# EasyEDA Pro project JP_Board.eprj, schematic Schematic1

## Sheets
1 MCU: Board Name: Board1; Create Date: 2025-09-01; Page Name: MCU; Project Name: JP_Board; Schematic Name: Schematic1; Update Date: 2025-11-07; Company: EasyEDA.com; Page Size: A4; Version: V1.0
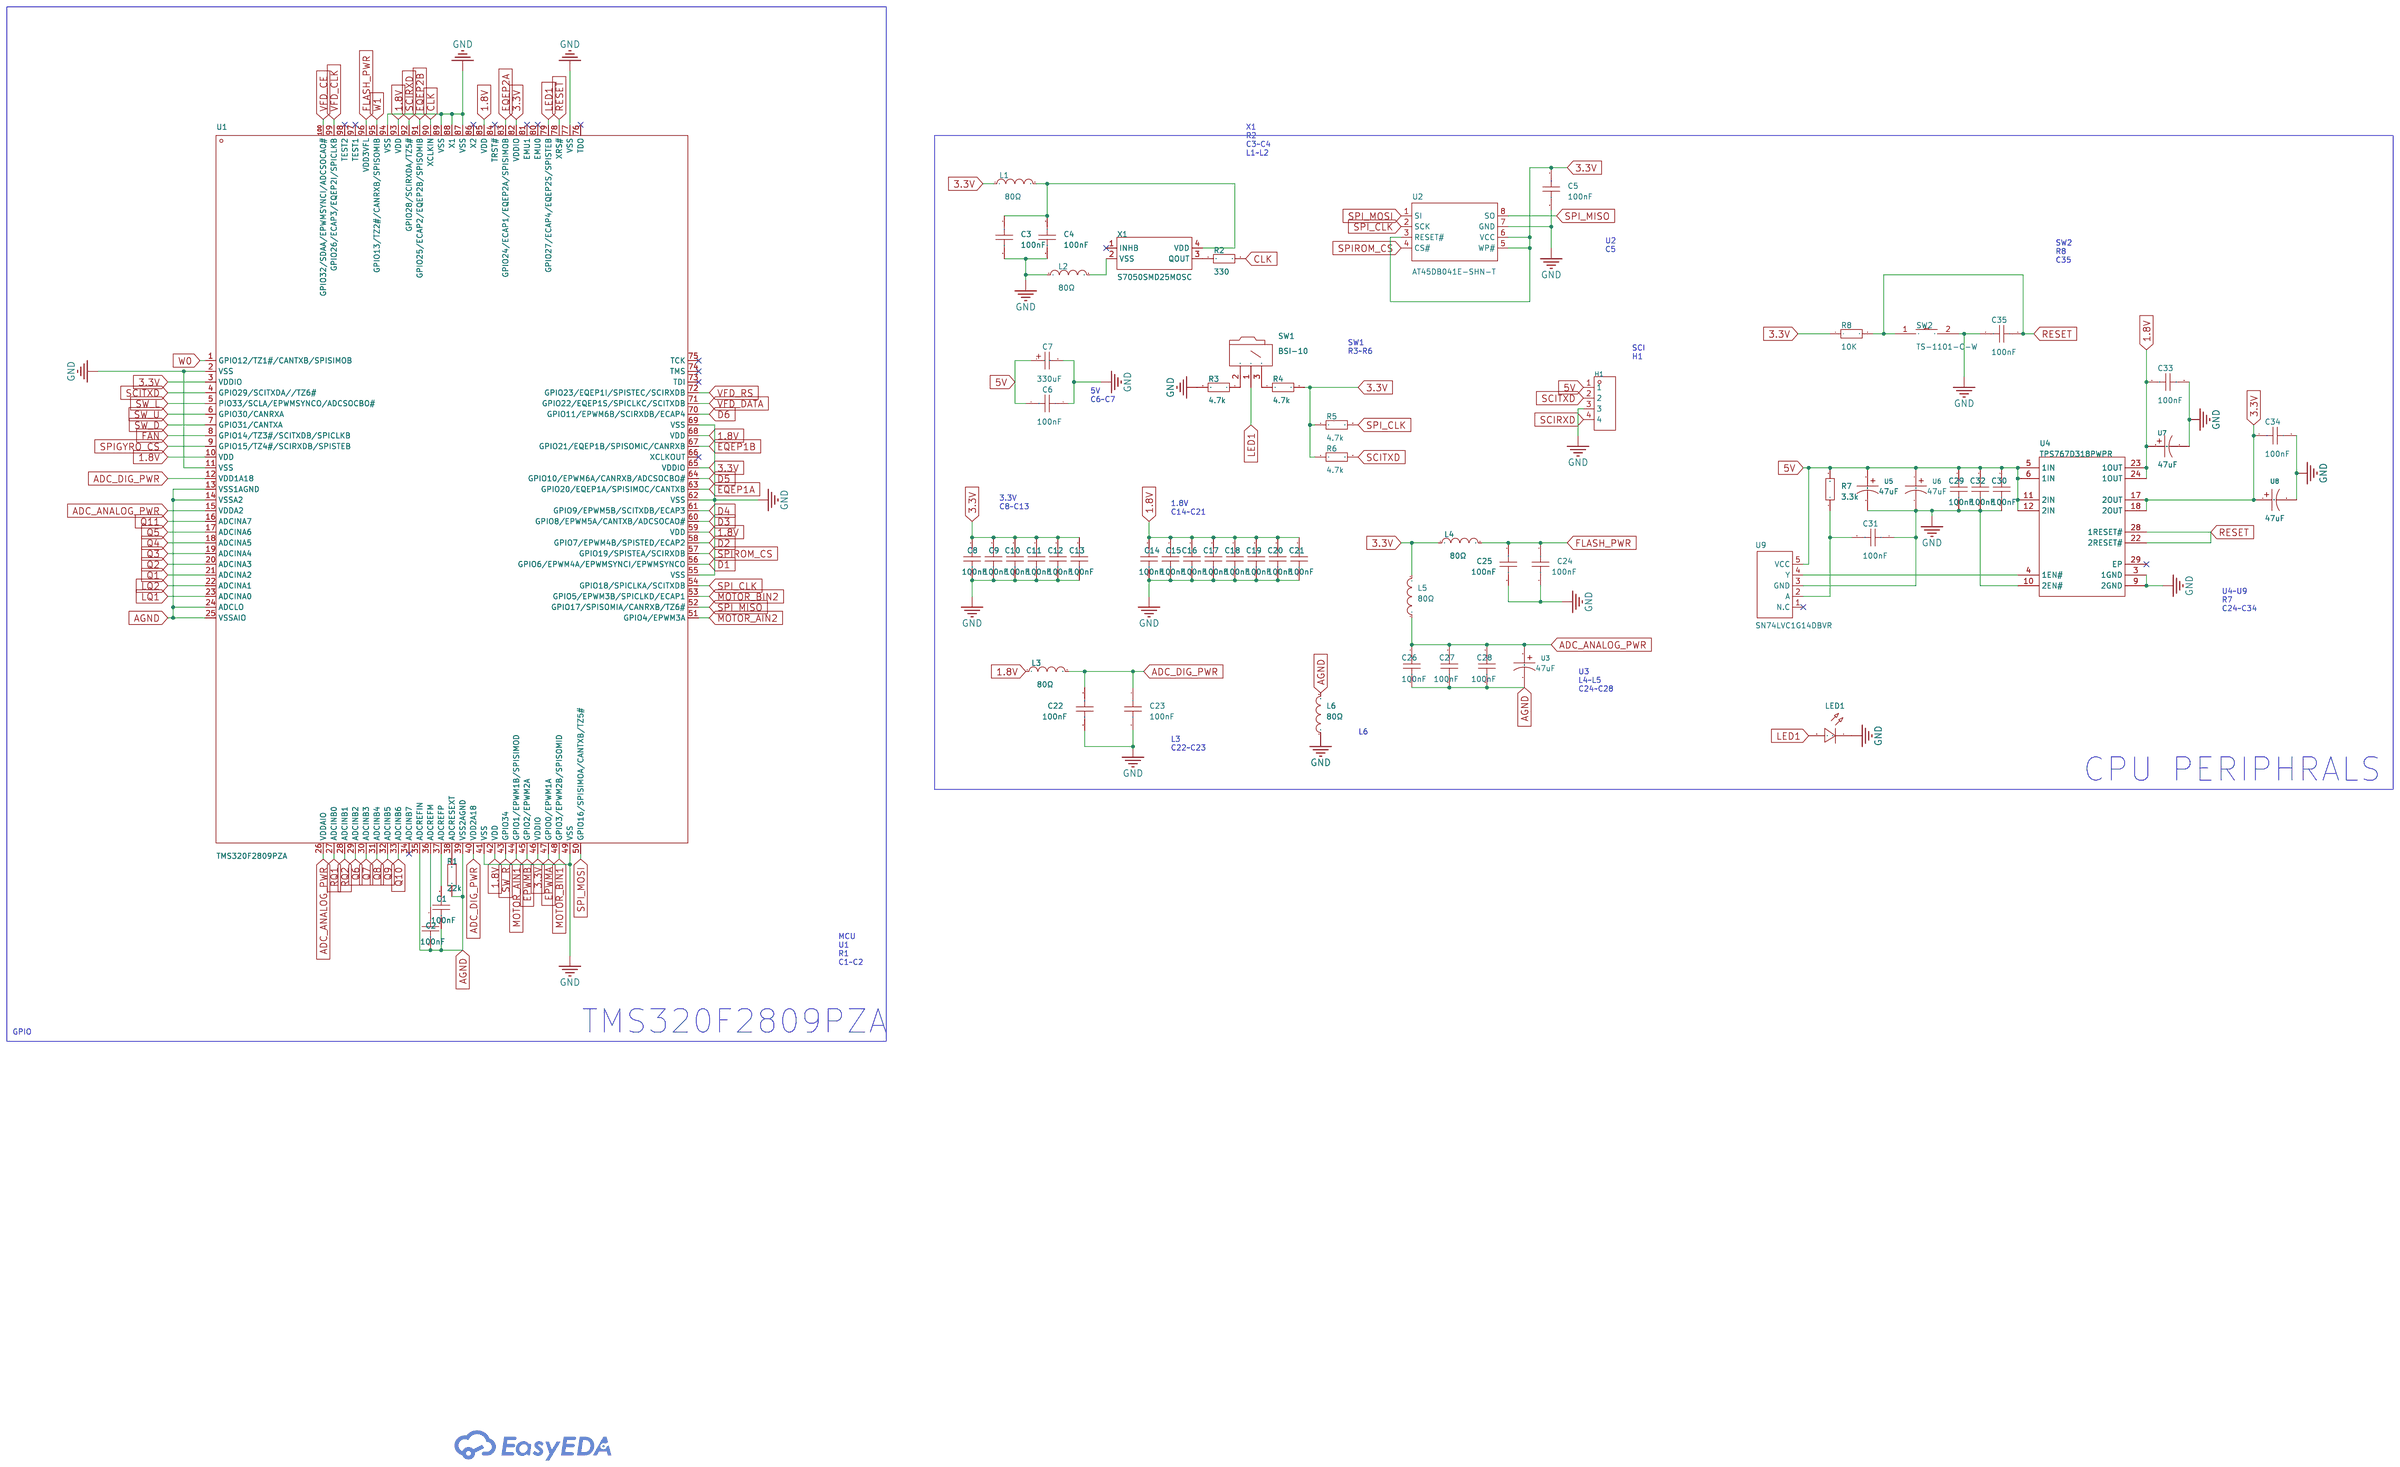
[diagram p0: MCU]
2 etc: Create Date: 2025-09-11; Page Name: etc; Update Date: 2025-11-08
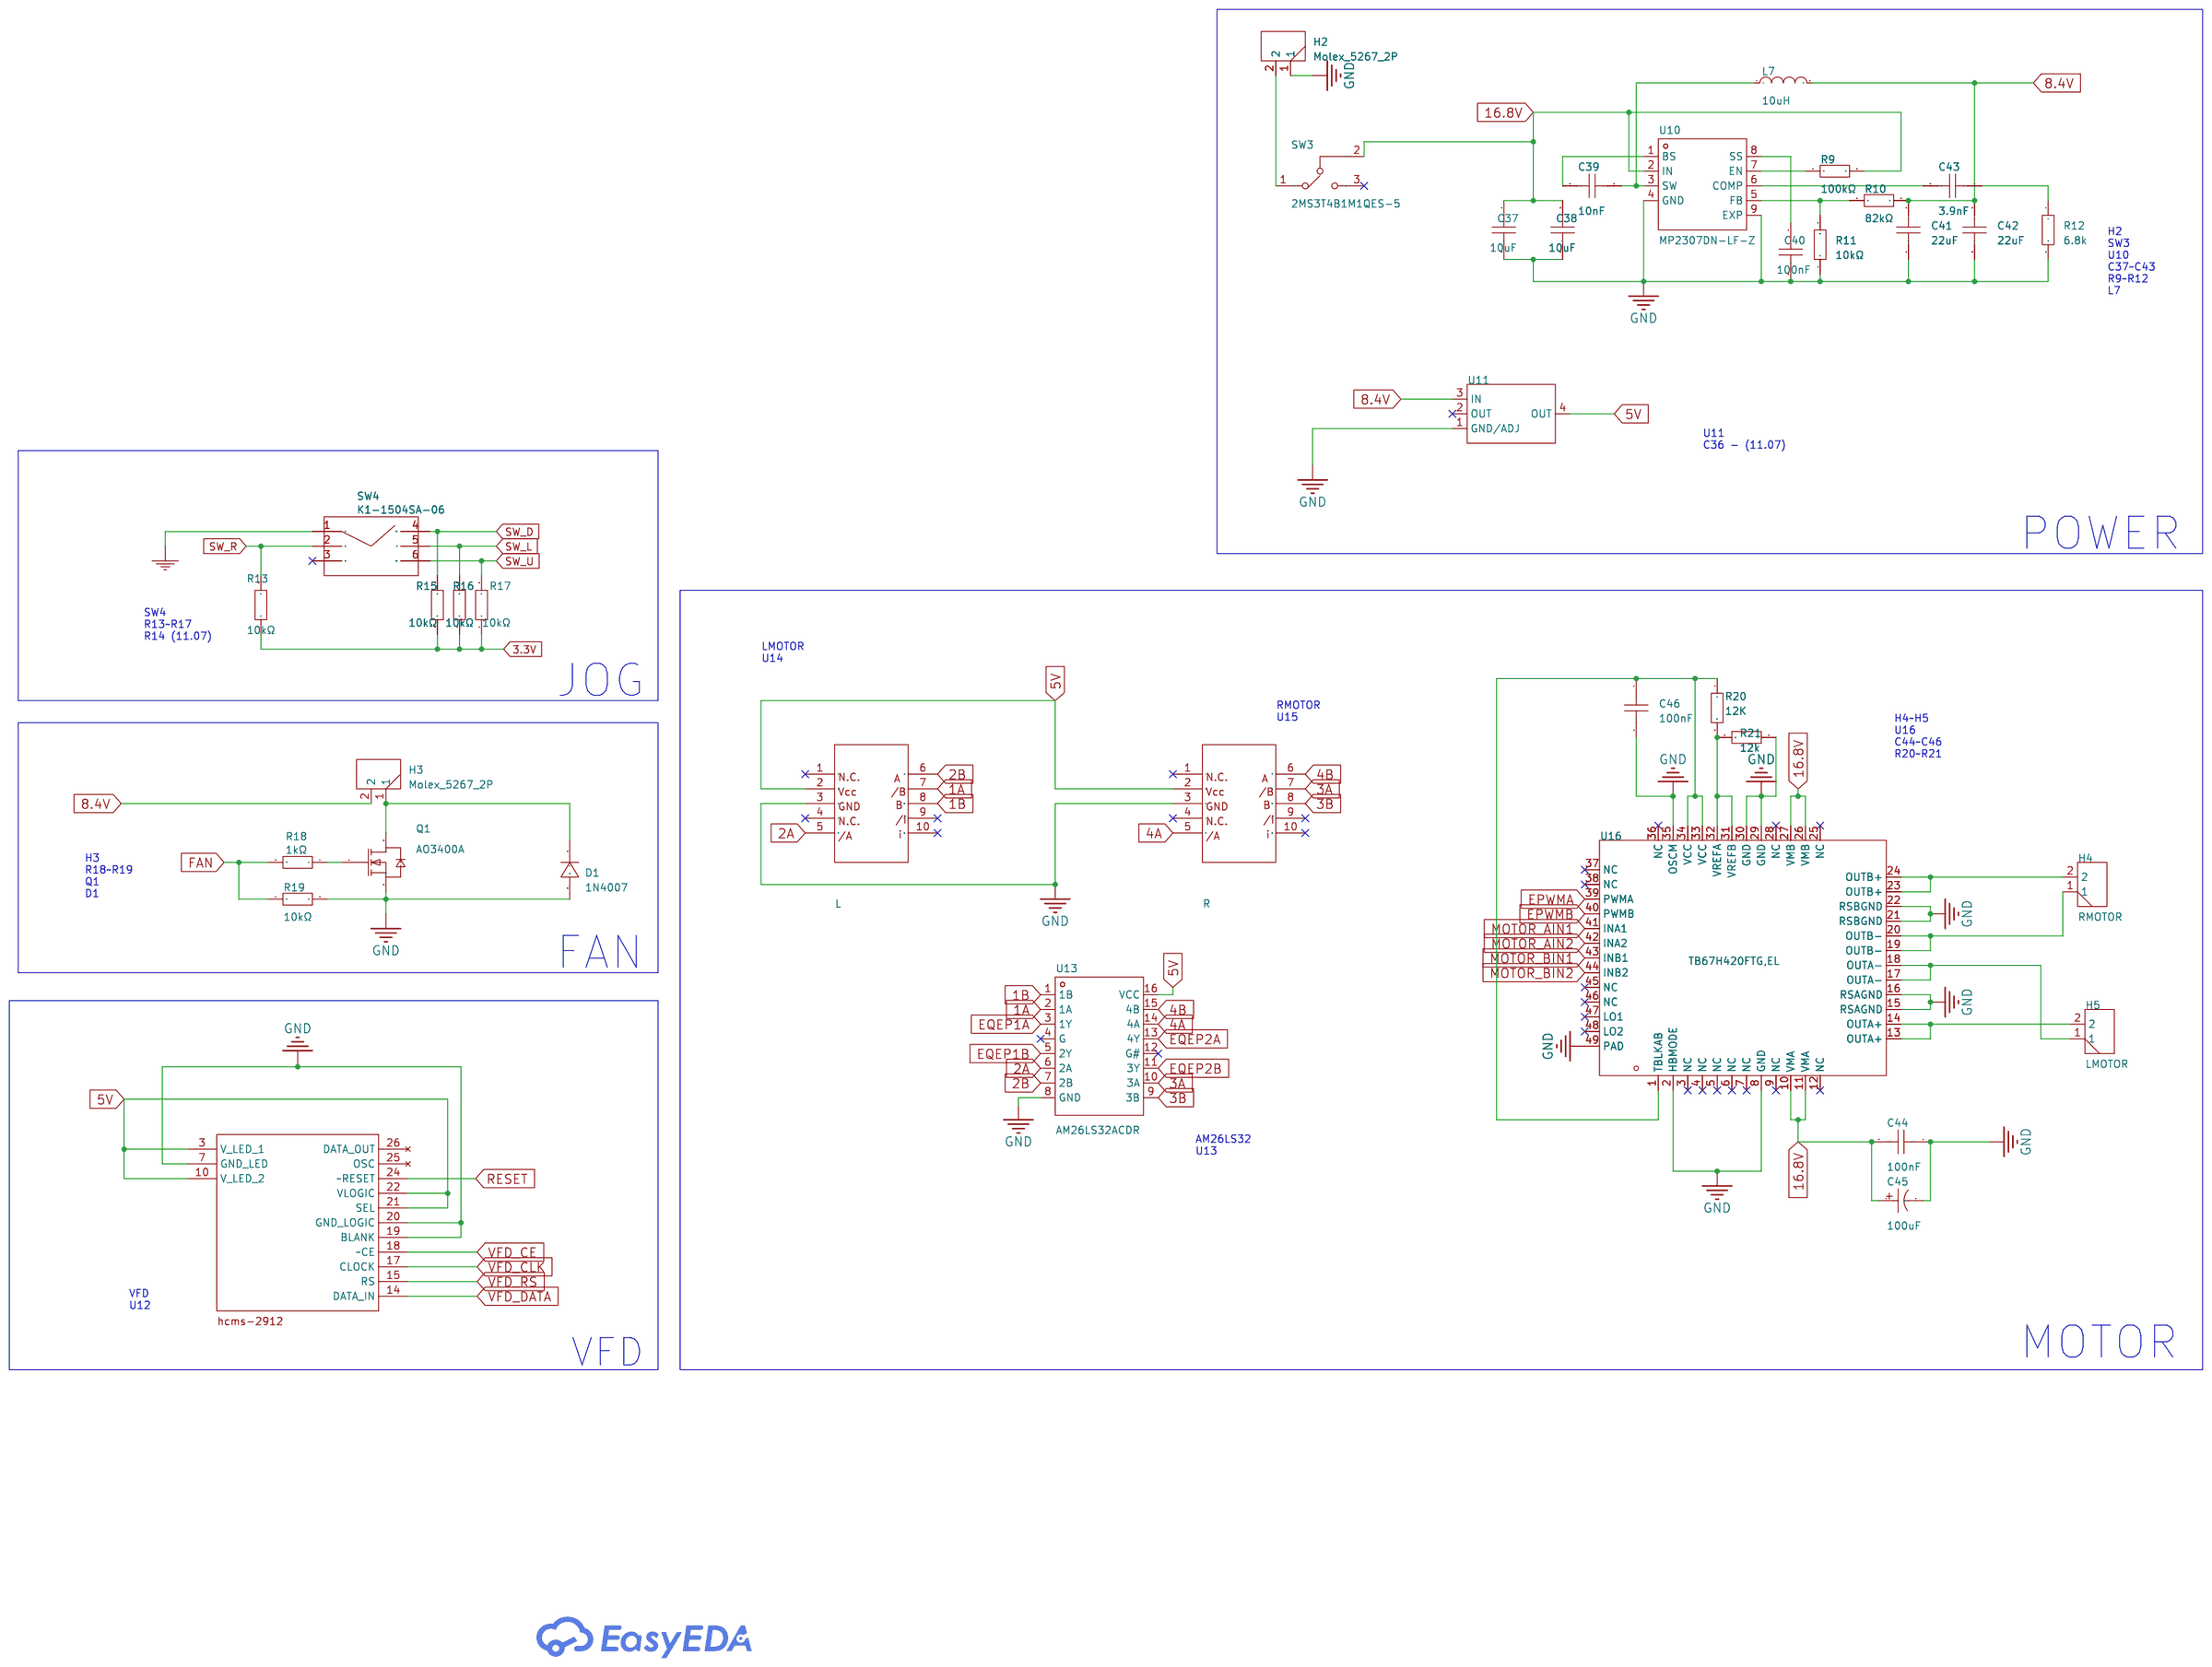
[diagram p1: etc]
3 SENSOR: Create Date: 2025-09-11; Page Name: SENSOR
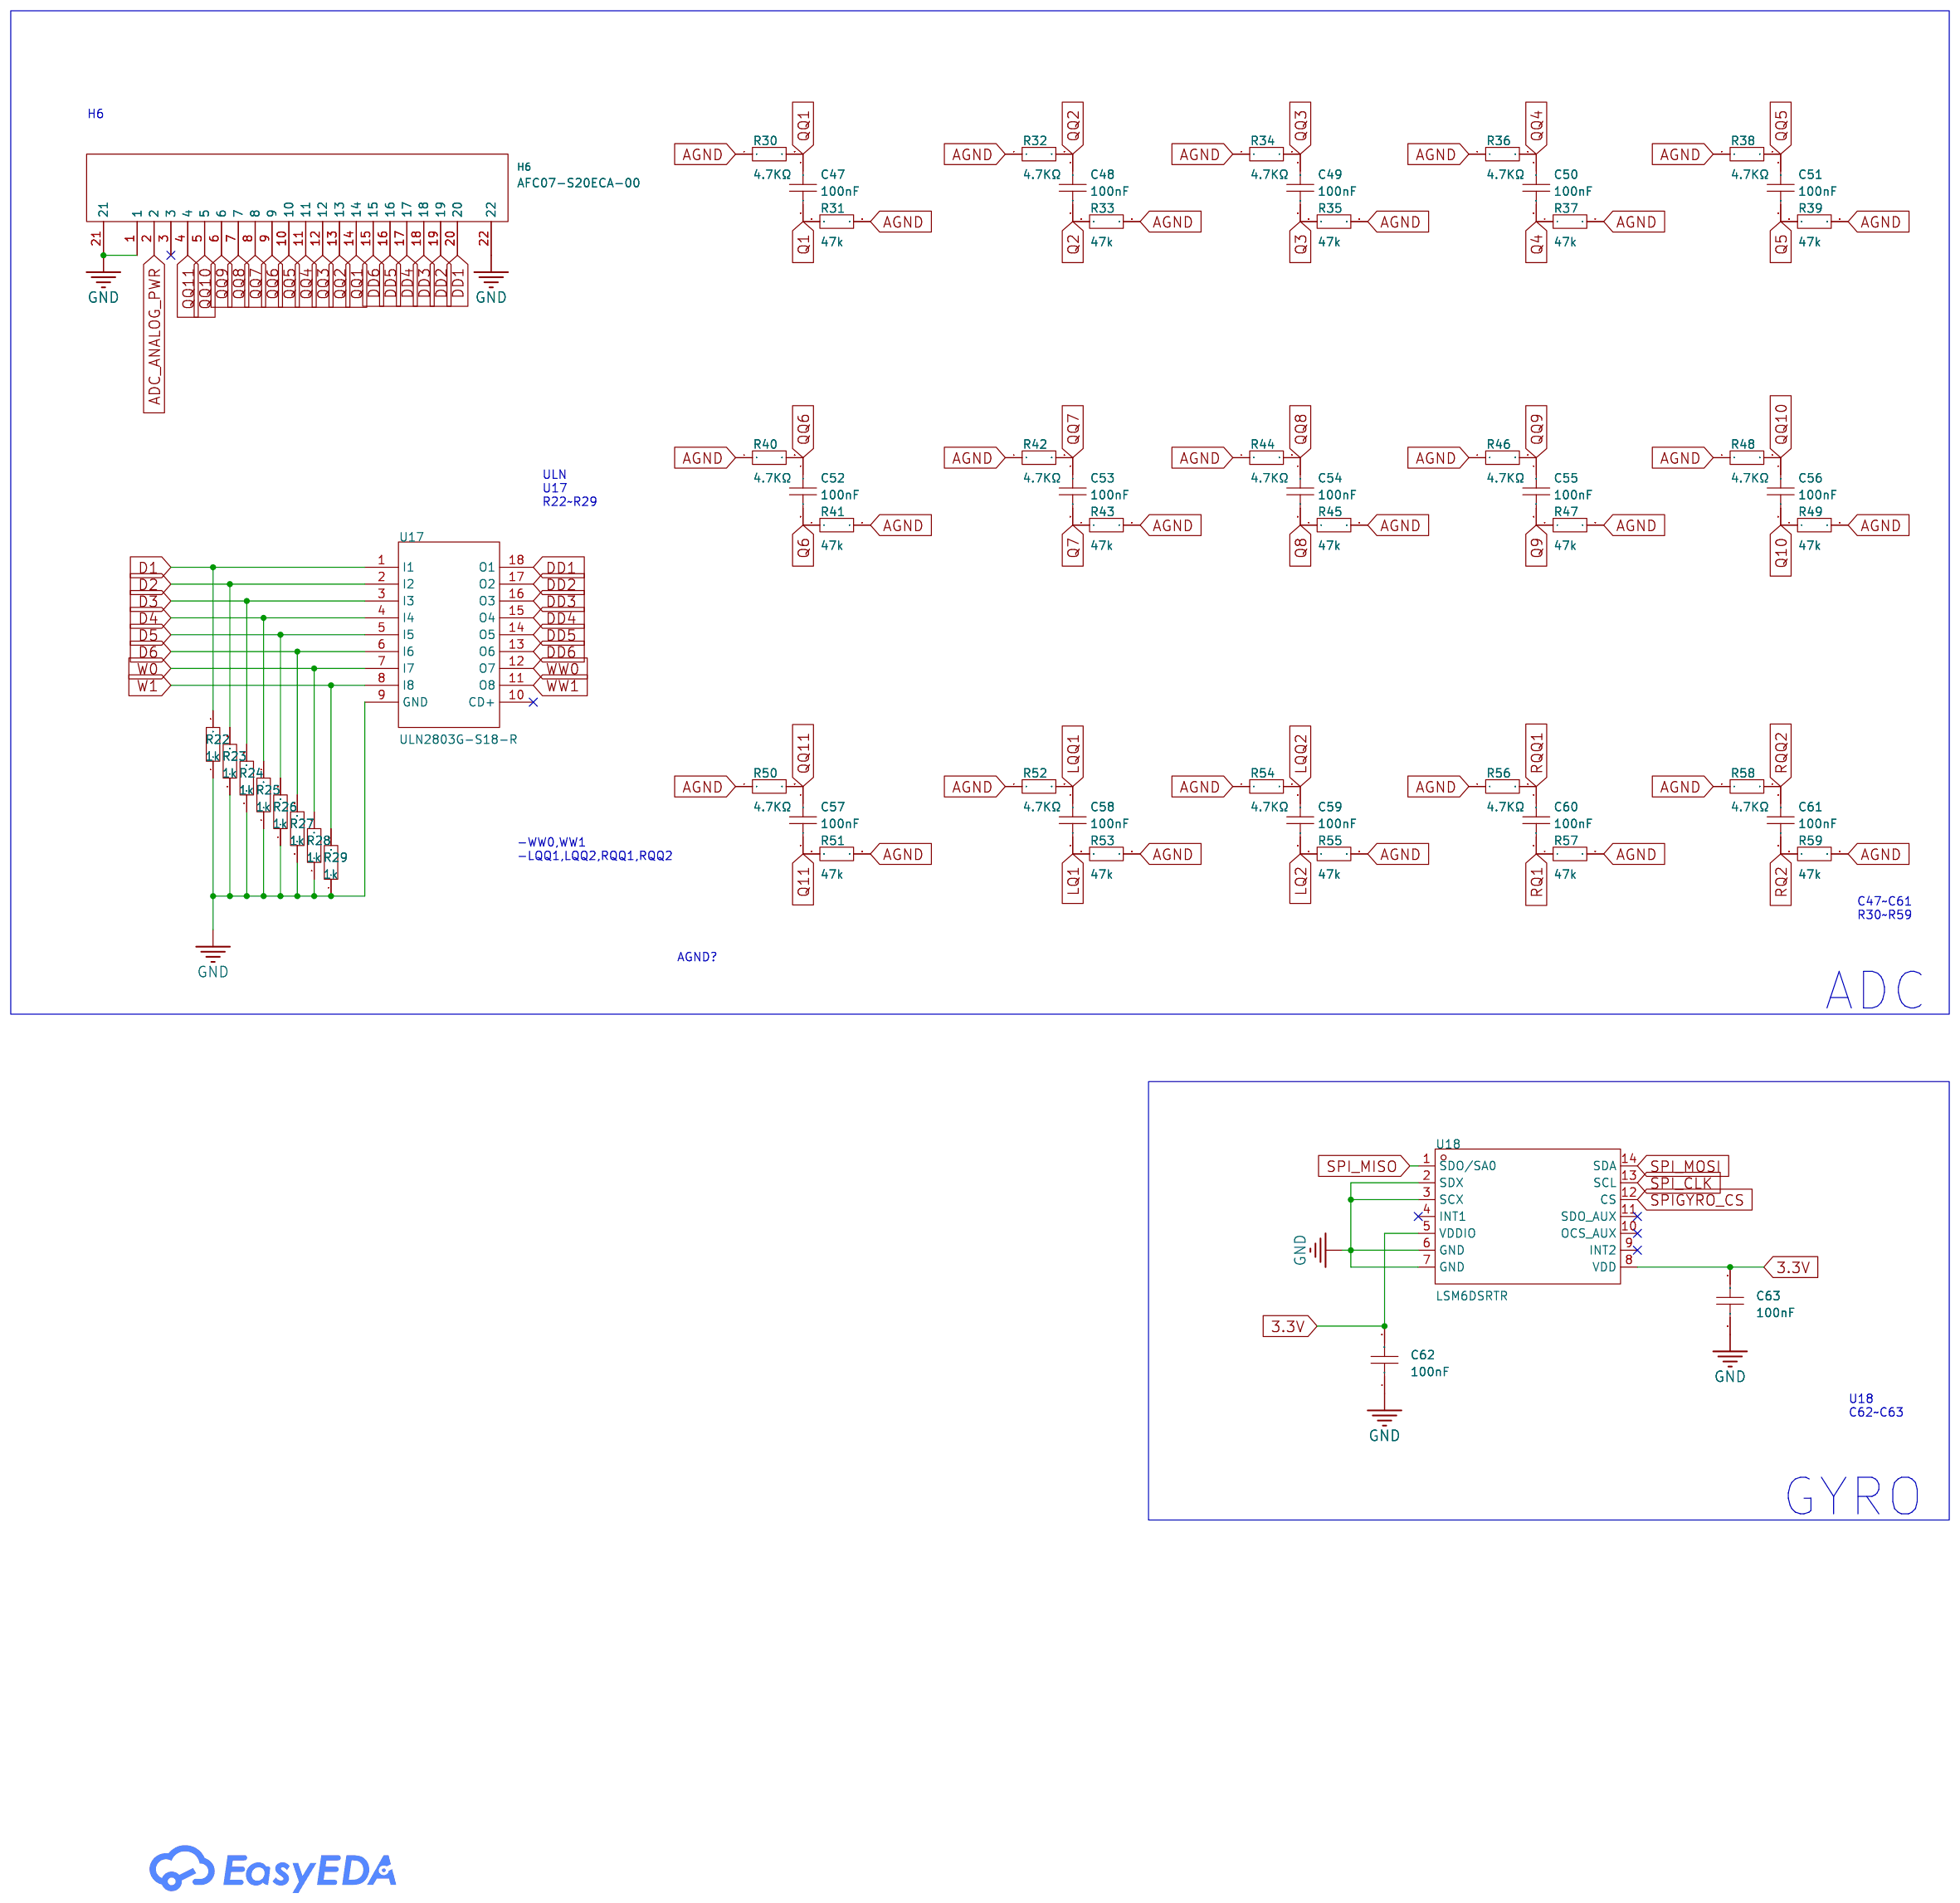
[diagram p2: SENSOR]

## Parts
sheet etc
C37  10uF  [C0603]
C38  10uF  [C0603]
C39  10nF  [C0603]
C40  100nF  [C0603]
C41  22uF  [C0603]
C42  22uF  [C0603]
C43  3.9nF  [C0603]
C44  100nF  [C0603]
C45  100uF  [CAP-SMD_BD6.3-L6.6-W6.6-FD]
C46  100nF  [C0603]
D1  1N4007  [SMA_L4.4-W2.8-LS5.4-RD]
H2  Molex_5267_2P  [5267_2P]
H3  Molex_5267_2P  [5267_2P]
H4  RMOTOR  [5267_2P]
H5  LMOTOR  [5267_2P]
L7  10uH  [IND-SMD_L7.3-W6.6]
Q1  AO3400A  [SOT-23-3_L3.0-W1.6-P1.90-LS2.8-BR]
R9  100kΩ  [R0603]
R10  82kΩ  [R0603]
R11  10kΩ  [R0603]
R12  6.8k  [R0603]
R13  10kΩ  [R0603]
R15  10kΩ  [R0603]
R16  10kΩ  [R0603]
R17  10kΩ  [R0603]
R18  1kΩ  [R0603]
R19  10kΩ  [R0603]
R20  12K  [R0603]
R21  12k  [R0603]
SW3  2MS3T4B1M1QES-5  [SW-TH_2MS3T4B1M1QES-5]
SW4  K1-1504SA-06  [SW-SMD_K1-1504SA-06]
U10  MP2307DN-LF-Z  [SOP-8_L4.9-W3.9-P1.27-LS6.0-BL-EP]
U11  AMS1117-5.0  [SOT-223-4_L6.5-W3.5-P2.30-LS7.0-BR]
U12  -  [HCMS-2912]
U13  AM26LS32ACDR  [SOIC-16_L9.9-W3.9-P1.27-LS6.0-BL]
U14  L  [Encoder]
U15  R  [Encoder]
U16  TB67H420FTG,EL  [QFN-48_L7.0-W7.0-P0.50-BL-EP5.4]
sheet MCU
C1  100nF  [C0603]
C2  100nF  [C0603]
C3  100nF  [C0603]
C4  100nF  [C0603]
C5  100nF  [C0603]
C6  100nF  [C0603]
C7  330uF  [CASE-D_7343]
C8  100nF  [C0603]
C9  100nF  [C0603]
C10  100nF  [C0603]
C11  100nF  [C0603]
C12  100nF  [C0603]
C13  100nF  [C0603]
C14  100nF  [C0603]
C15  100nF  [C0603]
C16  100nF  [C0603]
C17  100nF  [C0603]
C18  100nF  [C0603]
C19  100nF  [C0603]
C20  100nF  [C0603]
C21  100nF  [C0603]
C22  100nF  [C0603]
C23  100nF  [C0603]
C24  100nF  [C0603]
C25  100nF  [C0603]
C26  100nF  [C0603]
C27  100nF  [C0603]
C28  100nF  [C0603]
C29  100nF  [C0603]
C30  100nF  [C0603]
C31  100nF  [C0603]
C32  100nF  [C0603]
C33  100nF  [C0603]
C34  100nF  [C0603]
C35  100nF  [C0603]
H1  -  [HDR-TH_4P-P2.54-V-F]
L1  80Ω  [L0603]
L2  80Ω  [L0603]
L3  80Ω  [L0603]
L4  80Ω  [L0603]
L5  80Ω  [L0603]
L6  80Ω  [L0603]
LED1  -  [LED0603-R-RD]
R1  22k  [R0603]
R2  330  [R0603]
R3  4.7k  [R0603]
R4  4.7k  [R0603]
R5  4.7k  [R0603]
R6  4.7k  [R0603]
R7  3.3k  [R0603]
R8  10K  [R0603]
SW1  BSI-10  [SW-TH_BSI-10]
SW2  TS-1101-C-W  [SW-SMD_L6.0-W3.3-LS8.0]
U1  TMS320F2809PZA  [LQFP-100_L14.0-W14.0-P0.50-LS16.0-BL]
U2  AT45DB041E-SHN-T  [SOIC-8_L5.3-W5.3-P1.27-LS8.0-BL]
U3  47uF  [CAP-SMD_L1.6-W0.8]
U4  TPS767D318PWPR  [TSSOP-28_L9.7-W4.4-P0.65-LS6.4-BL-EP5.5]
U5  47uF  [CAP-SMD_L1.6-W0.8]
U6  47uF  [CAP-SMD_L1.6-W0.8]
U7  47uF  [CAP-SMD_L1.6-W0.8]
U8  47uF  [CAP-SMD_L1.6-W0.8]
U9  SN74LVC1G14DBVR  [SOT-23-5_L3.0-W1.7-P0.95-LS2.8-BR]
X1  S7050SMD25MOSC  [OSC-SMD_4P-L7.0-W5.0-BL-2]
sheet SENSOR
C47  100nF  [C0603]
C48  100nF  [C0603]
C49  100nF  [C0603]
C50  100nF  [C0603]
C51  100nF  [C0603]
C52  100nF  [C0603]
C53  100nF  [C0603]
C54  100nF  [C0603]
C55  100nF  [C0603]
C56  100nF  [C0603]
C57  100nF  [C0603]
C58  100nF  [C0603]
C59  100nF  [C0603]
C60  100nF  [C0603]
C61  100nF  [C0603]
C62  100nF  [C0603]
C63  100nF  [C0603]
H6  AFC07-S20ECA-00  [FPC-SMD_AFC07-S20ECA-00]
R22  1k  [R0603]
R23  1k  [R0603]
R24  1k  [R0603]
R25  1k  [R0603]
R26  1k  [R0603]
R27  1k  [R0603]
R28  1k  [R0603]
R29  1k  [R0603]
R30  4.7KΩ  [R0603]
R31  47k  [R0603]
R32  4.7KΩ  [R0603]
R33  47k  [R0603]
R34  4.7KΩ  [R0603]
R35  47k  [R0603]
R36  4.7KΩ  [R0603]
R37  47k  [R0603]
R38  4.7KΩ  [R0603]
R39  47k  [R0603]
R40  4.7KΩ  [R0603]
R41  47k  [R0603]
R42  4.7KΩ  [R0603]
R43  47k  [R0603]
R44  4.7KΩ  [R0603]
R45  47k  [R0603]
R46  4.7KΩ  [R0603]
R47  47k  [R0603]
R48  4.7KΩ  [R0603]
R49  47k  [R0603]
R50  4.7KΩ  [R0603]
R51  47k  [R0603]
R52  4.7KΩ  [R0603]
R53  47k  [R0603]
R54  4.7KΩ  [R0603]
R55  47k  [R0603]
R56  4.7KΩ  [R0603]
R57  47k  [R0603]
R58  4.7KΩ  [R0603]
R59  47k  [R0603]
U17  ULN2803G-S18-R  [SOIC-18_L11.6-W7.5-P1.27-LS10.3-BL]
U18  LSM6DSRTR  [LGA-14_L3.0-W2.5-P0.50-BR]

## Library data of the parts
C37-C44 C46-C63 = CC0603KRX7R9BB104: Capacitance:100nF Tolerance:±10% Tolerance:±10% Voltage Rating:50V Temperature Coefficient:X7R; LCSC Part Name: 100nF ±10% 50V; Supplier Part: C14663; Manufacturer: YAGEO(国巨); Supplier Footprint: 0603; JLCPCB Part Class: Basic Part; Datasheet: https://item.szlcsc.com/datasheet/CC0603KRX7R9BB104/15331.html; Supplier: LCSC; Tolerance: ±10%; Voltage Rating: 50V; Temperature Coefficient: X7R
C45 = RT1C101M0605: LCSC Part Name: 100uF ±20% 16V; Supplier Part: C267461; Manufacturer: ROQANG(容强); Supplier Footprint: SMD,D6.3xL5.4mm; JLCPCB Part Class: Extended Part; Datasheet: https://atta.szlcsc.com/upload/public/pdf/source/20180813/C267472_55C74989F74FEE2EA57202A0C1074BEF.pdf; Supplier: LCSC; Tolerance: ±20%; Voltage Rating: 16V; Ripple Current: 58mA@120Hz; Diameter: 6.3mm; Height - Seated (Max): 5.4mm; Lifetime: 2000hrs@125℃; Operating Temperature: -40℃~+105℃
D1 = 1N4007_C126233: Diode Configuration:Independent Type Forward Voltage (Vf@If):1.1V@1A Reverse Voltage (Vr): Rectified Current: Reverse Leakage Current (Ir):5uA@1kV; LCSC Part Name: 停产; Supplier Part: C126233; Manufacturer: SHIKUES(时科); Supplier Footprint: SMA(DO-214AC); JLCPCB Part Class: Extended Part; Datasheet: https://atta.szlcsc.com/upload/public/pdf/source/20170818/C126233_1503051236073895256.pdf; Supplier: LCSC; Diode Configuration: Independent Type; Forward Voltage (Vf@If): 1.1V@1A; Reverse Leakage Current (Ir): 5uA@1kV
H2-H5 = Molex_5267_2P
L7 = BMRB00060630100MA1: Inductance:10uH Tolerance:±20% Tolerance:±20% Current Rating:4A Current - Saturation(Isat):5.5A DC Resistance(DCR):68mΩ Type:Magnetic Shielded Inductor Ratings:-; LCSC Part Name: 10uH ±20% 5.5A; Supplier Part: C5201679; Manufacturer: Chilisin(奇力新); Supplier Footprint: SMD,6.6x7.3mm; JLCPCB Part Class: Extended Part; Datasheet: https://item.szlcsc.com/datasheet/BMRB00060630100MA1/5890754.html; Supplier: LCSC; Tolerance: ±20%; Current Rating: 4A; Current - Saturation(Isat): 5.5A; DC Resistance(DCR): 68mΩ; Type: Magnetic Shielded Inductor
Q1 = AO3400A_C5224194: LCSC Part Name: N沟道,电流:5.8A,耐压:30V; Supplier Part: C5224194; Manufacturer: ElecSuper(静芯); Supplier Footprint: SOT23-3L; JLCPCB Part Class: Extended Part; Datasheet: https://item.szlcsc.com/datasheet/AO3400A/5925703.html; Supplier: LCSC; Number: 1 N-Channel; Drain to Source Voltage: 30V; Current - Continuous Drain(Id): 5.8A; RDS(on): 21mΩ@10V; Pd - Power Dissipation: 1.4W; Gate Threshold Voltage (Vgs(th)): 1V@250uA; Gate Charge(Qg): 6.7nC@4.5V; Input Capacitance(Ciss): 550pF; Reverse Transfer Capacitance (Crss@Vds): 48pF; Operating Temperature: -55℃~+150℃; Type: N-Channel; Output Capacitance(Coss): 62pF
R9 R11 R19 = SCR0603J10K: Type:Thick Film Resistors Resistance: Tolerance:±5% Tolerance:±5% Power(Watts): Overload Voltage (Max): Operating Temperature Range:-55℃~+155℃ Operating Temperature Range:-55℃~+155℃; LCSC Part Name: 厚膜电阻 10kΩ ±5% 100mW; Supplier Part: C3017715; Manufacturer: VO(翔胜); Supplier Footprint: 0603; JLCPCB Part Class: Extended Part; Datasheet: https://atta.szlcsc.com/upload/public/pdf/source/20220513/247AF9639BA21CF93567DC289CCC6A22.pdf; Supplier: LCSC; Type: Thick Film Resistors; Tolerance: ±5%; Operating Temperature Range: -55℃~+155℃
R10 = FRR0603J103 TS: Type:Thick Film Resistor Resistance:10kΩ Tolerance:±5% Tolerance:±5% Power(Watts):100mW Voltage-Supply(Max):75V Temperature Coefficient:±100ppm/℃ Temperature Coefficient:±100ppm/℃ Operating Temperature:-55℃~+155℃ Operating Temperature:-55℃~+155℃; LCSC Part Name: 厚膜电阻 0603 10KΩ ±5% 100mW; Supplier Part: C49196789; Manufacturer: FOJAN(富捷); Supplier Footprint: 0603; JLCPCB Part Class: Extended Part; Datasheet: https://item.szlcsc.com/datasheet/FRR0603J103%2520TS/51599037.html; Supplier: LCSC; Type: Thick Film Resistor; Tolerance: ±5%; Power(Watts): 100mW; Voltage-Supply(Max): 75V; Temperature Coefficient: ±100ppm/℃; Operating Temperature: -55℃~+155℃
R12 = 0603WAF1003T5E: Type:Thick Film Resistor Resistance:100kΩ Tolerance:±1% Tolerance:±1% Power(Watts):100mW Voltage-Supply(Max):75V Temperature Coefficient:±100ppm/℃ Temperature Coefficient:±100ppm/℃ Operating Temperature:-55℃~+155℃ Operating Temperature:-55℃~+155℃; LCSC Part Name: 100kΩ ±1% 100mW 厚膜电阻; Supplier Part: C25803; Manufacturer: UNI-ROYAL(厚声); Supplier Footprint: 0603; JLCPCB Part Class: Basic Part; Datasheet: https://item.szlcsc.com/datasheet/0603WAF1003T5E/26546.html; Supplier: LCSC; Type: Thick Film Resistor; Tolerance: ±1%; Power(Watts): 100mW; Voltage-Supply(Max): 75V; Temperature Coefficient: ±100ppm/℃; Operating Temperature: -55℃~+155℃
R13 R15-R17 = 10kΩ: Supplier: LCSC; Manufacturer: UNI-ROYAL(厚声); Manufacturer Part: 0603WAF1002T5E; Supplier Part: C25804; JLCPCB Part Class: Basic Part
R18 = 1kΩ: Supplier: LCSC; Manufacturer: UNI-ROYAL(厚声); Manufacturer Part: 0603WAF1001T5E; Supplier Part: C21190; JLCPCB Part Class: Basic Part; link: https://lcsc.com/eda_search?q=C21190&%26type=1&ref=editor
R1-R8 R20-R29 R31 R33 R35 R37 R39 R41 R43 R45 R47 R49 R51 R53 R55 R57 R59 = Res_0603: Supplier Footprint: 0603
SW3 = 2MS3T4B1M1QES-5: LCSC Part Name: 三件套 开关 3件套; Supplier Part: C1122353; Manufacturer: Dailywell(德利威); Supplier Footprint: 插件,8.1x5.1mm; JLCPCB Part Class: Extended Part; Datasheet: https://item.szlcsc.com/datasheet/2MS3T4B1M1QES-5/1212718.html; Supplier: LCSC; Circuit: SPDT; Length: 8.13mm; Width: 5.08mm; Switch Height: 26.93mm; Life: 30,000 Cycles; Current Rating: 3A; Voltage Rating (AC): 120V; Voltage Rating (DC): 28V; Actuator Type: Cylinder Lever; Termination Style: PC Pin; Mounting Type: Through Hole; Operating Temperature: -30℃~+85℃
SW4 = K1-1504SA-06: Supplier: LCSC; Manufacturer: 韩国韩荣; Supplier Part: C136712; JLCPCB Part Class: Extended Part
U10 = MP2307DN-LF-Z: Function:Buck Output Type:Adjustable Voltage - Supply:4.75V~23V Voltage - Supply:4.75V~23V Output Voltage:925mV~20V Output Voltage:925mV~20V Output Current:3A Frequency - Switching:- Frequency - Switching:- Operating Temperature:-40℃~+85℃ Operating Temper; LCSC Part Name: 3A，23V，340KHz同步整流降压转换器; Supplier Part: C18921; Manufacturer: MPS(芯源); Supplier Footprint: SOIC-8N-EP-150mil; JLCPCB Part Class: Extended Part; Datasheet: https://item.szlcsc.com/datasheet/MP2307DN-LF-Z/19624.html; Supplier: LCSC; Function: Buck; Output Type: Adjustable; Voltage - Supply: 4.75V~23V; Output Voltage: 925mV~20V; Output Current: 3A; Operating Temperature: -40℃~+85℃; Synchronous Rectifier: Yes; Number of Outputs: 1; Topology: Buck; Switch tube (built-in/external): Built-in
U11 = AMS1117-5.0_C489390: Output Type:Fixed Voltage - Supply:18V Output Voltage:5V Output Voltage:5V Output Current:800mA Power Supply Rejection Ratio (PSRR):- Voltage Dropout:1.3V@(800mA) Features:热关断(TSD) Output Configuration:Positive electrode Number of Outputs:1; LCSC Part Name: 输入18V 输出5V 800mA; Supplier Part: C489390; Manufacturer: KEXIN(科信); Supplier Footprint: SOT-223-4; JLCPCB Part Class: Extended Part; Datasheet: https://atta.szlcsc.com/upload/public/pdf/source/20200225/C489390_741098F4D0B289080ED6EC6326BDA35D.pdf; Supplier: LCSC; Output Type: Fixed; Voltage - Supply: 18V; Output Voltage: 5V; Output Current: 800mA; Voltage Dropout: 1.3V@(800mA); Features: 热关断(TSD); Output Configuration: Positive electrode; Number of Outputs: 1
U12 = HCMS-2912
U13 = AM26LS32ACDR: LCSC Part Name: 四路差分线接收器; Supplier Part: C6180; Manufacturer: TI(德州仪器); Supplier Footprint: SOIC-16; JLCPCB Part Class: Extended Part; Datasheet: https://www.ti.com/cn/lit/gpn/am26ls32ac; Supplier: LCSC; Type: Receivers; Number of Drivers: 0; Number of Receivers: 4; Voltage - Supply: 4.75V~5.25V; Operating Temperature: 0℃~+70℃
U14 U15 = Encoder
U16 = TB67H420FTG,EL: LCSC Part Name: 9A 有刷直流电机驱动芯片 5.5V; Supplier Part: C2150535; Manufacturer: TOSHIBA(东芝); Supplier Footprint: QFN-48-EP(7x7); JLCPCB Part Class: Extended Part; Datasheet: https://atta.szlcsc.com/upload/public/pdf/source/20210718/C2150535_772875BEA68F83793892421782555318.pdf; Supplier: LCSC
C1-C6 C8-C35 = CAP_0603: Supplier Footprint: 0603
C7 = TAJD337K010RNJ: LCSC Part Name: 330uF ±10% 10V; Supplier Part: C7226; Manufacturer: Kyocera AVX; Supplier Footprint: CASE-D-7343; JLCPCB Part Class: Extended Part; Datasheet: https://atta.szlcsc.com/upload/public/pdf/source/20160107/1457707750344.pdf; Supplier: LCSC; Tolerance: ±10%; Equivalent Series Resistance(ESR): 900mΩ@100kHz; Operating Temperature: -55℃~+125℃
H1 = HDR-F_2.54_1x4P: Supplier Footprint: Through
L1-L6 = L_0603
LED1 = LED_0603-B: Supplier Footprint: 0603
SW1 = BSI-10: LCSC Part Name: 滑动开关; Supplier Part: C2985934; Manufacturer: SM Switch; Supplier Footprint: 插件; JLCPCB Part Class: Extended Part; Datasheet: https://atta.szlcsc.com/upload/public/pdf/source/20220328/3D4D6021904ADB20DC9F4CC49FD198C4.pdf; Supplier: LCSC
SW2 = TS-1101-C-W: Circuit:SPST Actuator Style:Rectangle button Operating Force:260gf Mounting Style:Brick nogging Switch Length:6mm Switch Width:3.6mm Switch Height:2.5mm Strike Gundam:不带 Contact Current:50mA Voltage Rating (AC):- Voltage Rating (DC):12V Power Rating:- Ins; LCSC Part Name: 6*3.6*2.5mm 立贴 轻触开关; Supplier Part: C318938; Manufacturer: XKB Connectivity(中国星坤); Supplier Footprint: SMD; JLCPCB Part Class: Extended Part; Datasheet: https://atta.szlcsc.com/upload/public/pdf/source/20200227/C318938_C2E53B1EEDE37D980A33616AC086DE53.pdf; Supplier: LCSC; Circuit: SPST; Actuator Style: Rectangle button; Operating Force: 260gf; Mounting Style: Brick nogging; Switch Length: 6mm; Switch Width: 3.6mm; Switch Height: 2.5mm; Strike Gundam: 不带; Contact Current: 50mA; Voltage Rating (DC): 12V; Actuator/Cap Color: 白色带淡绿; With Lamp: No; Mechanical Life: 5万次; Operating Temperature: -30℃~+85℃
U1 = TMS320F2809PZA: LCSC Part Name: 具有 100MHz 频率、256KB 闪存、12 通道 PWM 的 C2000™ 32 位 MCU; Supplier Part: C190431; Manufacturer: TI(德州仪器); Supplier Footprint: LQFP-100(14x14); JLCPCB Part Class: Extended Part; Datasheet: https://www.ti.com/cn/lit/gpn/tms320f2802-q1; Supplier: LCSC; Program Storage Size: 256KB; GPIO Ports Number: 35; Operating Voltage Range: 1.71V~1.89V; CPU Maximum Speed: 100MHz; Operating Temperature Range: -40℃~+85℃; ADC (Bit): 12bit; Watchdog: Yes; Low-Voltage Detect: Yes; Internal Oscillator: Yes
U2 = AT45DB041E-SHN-T: LCSC Part Name: 4 Mbit数据闪存，最低工作电压1.65V，SPI串行闪存; Supplier Part: C63570; Manufacturer: RENESAS(瑞萨)/IDT; Supplier Footprint: SOIC-8-208mil; Datasheet: https://item.szlcsc.com/datasheet/AT45DB041E-SHN-T/64633.html; Supplier: LCSC; Interface: SPI; Memory Size: 4Mbit; Clock Frequency: 85MHz; Voltage - Supply: 1.65V~3.6V; Standby Supply Current: 25uA; Program / Erase Cycles: 100,000 Cycles; Page Programming Time (Tpp): 3ms; Data Retention - TDR (Year): 20 Years; Operating Temperature: -40℃~+85℃
U3 U5-U8 = F980G476MMA: LCSC Part Name: 47uF ±20% 4V; Supplier Part: C1952755; Manufacturer: Kyocera AVX; Supplier Footprint: 0603; JLCPCB Part Class: Extended Part; Supplier: LCSC; Tolerance: ±20%; Voltage Rating: 4V; Ripple Current: 22mA@100kHz; Equivalent Series Resistance(ESR): 8Ω@100kHz; Operating Temperature: -55℃~+125℃
U4 = TPS767D318PWPR: Supplier Part: C9847; Supplier: LCSC; Manufacturer: TI(德州仪器); JLCPCB Part Class: Extended Part
U9 = SN74LVC1G14DBVR_C7835: LCSC Part Name: 单路施密特触发反相器; Supplier Part: C7835; Manufacturer: TI(德州仪器); Supplier Footprint: SOT-23-5; JLCPCB Part Class: Extended Part; Datasheet: https://www.ti.com/cn/lit/gpn/sn74lvc1g14; Supplier: LCSC; Input Type: Schmitt Trigger; Voltage - Supply: 1.65V~5.5V; Current - Supply: 10uA; Number of Circuits: 1; Number of Inputs: 1; Current - Output Low(IOL): 32mA; Current - Output High(IOH): 32mA; Input Logic Level - High: 1.16V~3.33V; Input Logic Level -Low: 390mV~1.87V; Max Propagation Delay: 6.5ns@2.5V,50pF; Series: 74LVCSeries
X1 = S7050SMD25MOSC: LCSC Part Name: 25MHz ±20ppm 1.8~5.0V; Supplier Part: C7431193; Manufacturer: SST(索斯特); Supplier Footprint: SMD7050-4P; Datasheet: https://item.szlcsc.com/datasheet/S7050SMD25MOSC/8432061.html; Supplier: LCSC
H6 = AFC07-S20ECA-00: Locking Feature:抽屉式 Contact Type:Contact,Top Number of Contacts:20P Pitch:0.5mm Mounting Type:卧贴 FFC, FCB Thickness:0.3mm FFC, FCB Thickness:0.3mm Height Above Board:2mm; LCSC Part Name: 间距:0.5mm P数:20P 抽屉式 上接; Supplier Part: C262641; Manufacturer: JS(钜硕电子); Supplier Footprint: SMD,P=0.5mm,卧贴; JLCPCB Part Class: Extended Part; Datasheet: https://atta.szlcsc.com/upload/public/pdf/source/20190726/C11082_A2E7B12387019CE4314BB5199EE0FDF4.pdf; Supplier: LCSC; Locking Feature: 抽屉式; Contact Type: Contact,Top; Number of Contacts: 20P; Pitch: 0.5mm; Mounting Type: 卧贴; FFC, FCB Thickness: 0.3mm; Height Above Board: 2mm
R30 R32 R34 R36 R38 R40 R42 R44 R46 R48 R50 R52 R54 R56 R58 = SCR0603F8R06: Type:Thick Film Resistors Resistance: Tolerance:±1% Tolerance:±1% Power(Watts): Overload Voltage (Max): Operating Temperature Range:-55℃~+155℃ Operating Temperature Range:-55℃~+155℃; LCSC Part Name: 厚膜电阻 8.06Ω ±1% 100mW; Supplier Part: C3016465; Manufacturer: VO(翔胜); Supplier Footprint: 0603; JLCPCB Part Class: Extended Part; Datasheet: https://atta.szlcsc.com/upload/public/pdf/source/20220513/247AF9639BA21CF93567DC289CCC6A22.pdf; Supplier: LCSC; Type: Thick Film Resistors; Tolerance: ±1%; Operating Temperature Range: -55℃~+155℃
U17 = ULN2803G-S18-R: Supplier Part: C33924; Manufacturer: UTC(友顺); Supplier Footprint: SOP-18; JLCPCB Part Class: Extended Part; Datasheet: https://atta.szlcsc.com/upload/public/pdf/source/20140723/1457707156679.pdf; Supplier: LCSC; number of channels: 八路
U18 = LSM6DSRTR: Supplier Part: C784817; Manufacturer: ST(意法半导体); Supplier Footprint: LGA-14(2.5x3); JLCPCB Part Class: Extended Part; Datasheet: https://item.szlcsc.com/datasheet/LSM6DSRTR/840864.html; Supplier: LCSC; Sensor Type: Accelerometer Gyroscope; Operating Temperature: -40℃~+85℃

## Nets
1.8V: C14.1 C15.1 C16.1 C17.1 C18.1 C19.1 C20.2 C21.2 C33.1 L3.1 U1.10(VDD) U1.42(VDD) U1.59(VDD) U1.68(VDD) U1.85(VDD) U1.93(VDD) U4.23(1OUT) U4.24(1OUT) U7.1
3.3V: C5.1 C8.1 C9.1 C10.1 C11.1 C12.1 C13.1 C34.1 C62.2 C63.1 L1.1 L4.1 L5.2 R4.2 R5.1 R6.1 R8.1 R13.1 R15.1 R16.1 R17.1 U1.3(VDDIO) U1.46(VDDIO) U1.65(VDDIO) U1.82(VDDIO) U2.3(RESET#) U2.5(WP#) U2.6(VCC) U4.17(2OUT) U4.18(2OUT) U8.1 U18.5(VDDIO) U18.8(VDD)
5V: C6.2 C7.1 C29.1 C30.1 C32.1 H1.1 R7.2 U4.5(1IN) U4.6(1IN) U4.11(2IN) U4.12(2IN) U5.1 U6.1 U9.5(VCC) U11.4(OUT) U12.3(V_LED_1) U12.10(V_LED_2) U12.21(SEL) U12.22(VLOGIC) U13.16(VCC) U14.2 U15.2
8.4V: C41.1 C42.1 H3.2 L7.2 R10.2 U11.3(IN)
16.8V: C37.1 C38.1 C44.2 C45.1 R9.2 SW3.2 U10.2(IN) U16.10(VMA) U16.11(VMA) U16.26(VMB) U16.27(VMB)
AGND: C1.1 C2.2 C26.2 C27.2 C28.2 L6.2 R1.1 R30.1 R31.2 R32.1 R33.2 R34.1 R35.2 R36.1 R37.2 R38.1 R39.2 R40.1 R41.2 R42.1 R43.2 R44.1 R45.2 R46.1 R47.2 R48.1 R49.2 R50.1 R51.2 R52.1 R53.2 R54.1 R55.2 R56.1 R57.2 R58.1 R59.2 U1.13(VSS1AGND) U1.14(VSSA2) U1.24(ADCLO) U1.25(VSSAIO) U1.35(ADCREFIN) U1.39(VSS2AGND) U3.2
GND: C3.2 C4.2 C5.2 C6.1 C7.2 C8.2 C9.2 C10.2 C11.2 C12.2 C13.2 C14.2 C15.2 C16.2 C17.2 C18.2 C19.2 C20.1 C21.1 C22.2 C23.2 C24.2 C25.2 C29.2 C30.2 C31.1 C32.2 C33.2 C34.2 C35.2 C37.2 C38.2 C40.2 C41.2 C42.2 C44.1 C45.2 C46.2 C62.1 C63.2 D1.2 H1.3 H2.1 H6.1 H6.21 H6.22 L2.1 L6.1 LED1.1(C) Q1.2(S) R3.2 R11.1 R12.2 R19.2 R21.1 R22.1 R23.1 R24.1 R25.1 R26.1 R27.1 R28.1 R29.1 SW2.2 SW4.1(A) U1.2(VSS) U1.11(VSS) U1.41(VSS) U1.49(VSS) U1.55(VSS) U1.62(VSS) U1.69(VSS) U1.77(VSS) U1.87(VSS) U1.88(X1) U1.89(VSS) U1.94(VSS) U2.7(GND) U4.3(1GND) U4.9(2GND) U4.10(2EN#) U5.2 U6.2 U7.2 U8.2 U9.3(GND) U10.4(GND) U10.9(EXP) U11.1(GND/ADJ) U12.7(GND_LED) U12.19(BLANK) U12.20(GND_LOGIC) U13.8(GND) U14.3 U15.3 U16.2(HBMODE) U16.8(GND) U16.15(RSAGND) U16.16(RSAGND) U16.21(RSBGND) U16.22(RSBGND) U16.29(GND) U16.30(GND) U16.35(OSCM) U16.49(PAD) U17.9(GND) U18.2(SDX) U18.3(SCX) U18.6(GND) U18.7(GND)
1A: U13.2(1A) U14.7
1B: U13.1(1B) U14.8
2A: U13.6(2A) U14.5
2B: U13.7(2B) U14.6
3A: U13.10(3A) U15.7
3B: U13.9(3B) U15.8
4A: U13.14(4A) U15.5
4B: U13.15(4B) U15.6
ADC_ANALOG_PWR: C26.1 C27.1 C28.1 H6.2 L5.1 U1.15(VDDA2) U1.26(VDDAIO) U3.1
ADC_DIG_PWR: C22.1 C23.1 L3.2 U1.12(VDD1A18) U1.40(VDD2A18)
CLK: R2.2 U1.90(XCLKIN)
D1: R22.2 U1.56(GPIO6/EPWM4A/EPWMSYNCI/EPWMSYNCO) U17.1(I1)
D2: R23.2 U1.58(GPIO7/EPWM4B/SPISTED/ECAP2) U17.2(I2)
D3: R24.2 U1.60(GPIO8/EPWM5A/CANTXB/ADCSOCAO#) U17.3(I3)
D4: R25.2 U1.61(GPIO9/EPWM5B/SCITXDB/ECAP3) U17.4(I4)
D5: R26.2 U1.64(GPIO10/EPWM6A/CANRXB/ADCSOCBO#) U17.5(I5)
D6: R27.2 U1.70(GPIO11/EPWM6B/SCIRXDB/ECAP4) U17.6(I6)
DD1: H6.20 U17.18(O1)
DD2: H6.19 U17.17(O2)
DD3: H6.18 U17.16(O3)
DD4: H6.17 U17.15(O4)
DD5: H6.16 U17.14(O5)
DD6: H6.15 U17.13(O6)
EPWMA: U1.47(GPIO0/EPWM1A) U16.39(PWMA)
EPWMB: U1.45(GPIO2/EPWM2A) U16.40(PWMB)
EQEP1A: U1.63(GPIO20/EQEP1A/SPISIMOC/CANTXB) U13.3(1Y)
EQEP1B: U1.67(GPIO21/EQEP1B/SPISOMIC/CANRXB) U13.5(2Y)
EQEP2A: U1.83(GPIO24/ECAP1/EQEP2A/SPISIMOB) U13.13(4Y)
EQEP2B: U1.91(GPIO25/ECAP2/EQEP2B/SPISOMIB) U13.11(3Y)
FAN: R18.2 R19.1 U1.8(GPIO14/TZ3#/SCITXDB/SPICLKB)
FLASH_PWR: C24.1 C25.1 L4.2 U1.96(VDD3VFL)
LED1: LED1.2(A) SW1.1 U1.79(GPIO27/ECAP4/EQEP2S/SPISTEB)
LQ1: C58.2 R53.1 U1.23(ADCINA0)
LQ2: C59.2 R55.1 U1.22(ADCINA1)
LQQ1: C58.1 R52.2
LQQ2: C59.1 R54.2
MOTOR_AIN1: U1.44(GPIO1/EPWM1B/SPISIMOD) U16.41(INA1)
MOTOR_AIN2: U1.51(GPIO4/EPWM3A) U16.42(INA2)
MOTOR_BIN1: U1.48(GPIO3/EPWM2B/SPISOMID) U16.43(INB1)
MOTOR_BIN2: U1.53(GPIO5/EPWM3B/SPICLKD/ECAP1) U16.44(INB2)
Q1: C47.2 R31.1 U1.21(ADCINA2)
Q2: C48.2 R33.1 U1.20(ADCINA3)
Q3: C49.2 R35.1 U1.19(ADCINA4)
Q4: C50.2 R37.1 U1.18(ADCINA5)
Q5: C51.2 R39.1 U1.17(ADCINA6)
Q6: C52.2 R41.1 U1.29(ADCINB2)
Q7: C53.2 R43.1 U1.30(ADCINB3)
Q8: C54.2 R45.1 U1.31(ADCINB4)
Q9: C55.2 R47.1 U1.32(ADCINB5)
Q10: C56.2 R49.1 U1.33(ADCINB6)
Q11: C57.2 R51.1 U1.16(ADCINA7)
QQ1: C47.1 H6.14 R30.2
QQ2: C48.1 H6.13 R32.2
QQ3: C49.1 H6.12 R34.2
QQ4: C50.1 H6.11 R36.2
QQ5: C51.1 H6.10 R38.2
QQ6: C52.1 H6.9 R40.2
QQ7: C53.1 H6.8 R42.2
QQ8: C54.1 H6.7 R44.2
QQ9: C55.1 H6.6 R46.2
QQ10: C56.1 H6.5 R48.2
QQ11: C57.1 H6.4 R50.2
RESET: C35.1 R8.2 SW2.1 U1.78(XRS#) U4.22(2RESET#) U4.28(1RESET#) U12.24(~RESET)
RQ1: C60.2 R57.1 U1.27(ADCINB0)
RQ2: C61.2 R59.1 U1.28(ADCINB1)
RQQ1: C60.1 R56.2
RQQ2: C61.1 R58.2
SCIRXD: H1.4 U1.92(GPIO28/SCIRXDA/TZ5#)
SCITXD: H1.2 R6.2 U1.4(GPIO29/SCITXDA//TZ6#)
SPI_CLK: R5.2 U1.54(GPIO18/SPICLKA/SCITXDB) U2.2(SCK) U18.13(SCL)
SPI_MISO: U1.52(GPIO17/SPISOMIA/CANRXB/TZ6#) U2.8(SO) U18.1(SDO/SA0)
SPI_MOSI: U1.50(GPIO16/SPISIMOA/CANTXB/TZ5#) U2.1(SI) U18.14(SDA)
SPIGYRO_CS: U1.9(GPIO15/TZ4#/SCIRXDB/SPISTEB) U18.12(CS)
SPIROM_CS: U1.57(GPIO19/SPISTEA/SCIRXDB) U2.4(CS#)
SW_D: R15.2 SW4.4(CENTER) U1.7(GPIO31/CANTXA)
SW_L: R16.2 SW4.5(D) U1.5(PIO33/SCLA/EPWMSYNCO/ADCSOCBO#)
SW_R: R13.2 SW4.2(B) U1.43(GPIO34)
SW_U: R17.2 SW4.6(COMMON) U1.6(GPIO30/CANRXA)
VFD_CE: U1.100(GPIO32/SDAA/EPWMSYNCI/ADCSOCAO#) U12.18(~CE)
VFD_CLK: U1.99(GPIO26/ECAP3/EQEP2I/SPICLKB) U12.17(CLOCK)
VFD_DATA: U1.71(GPIO22/EQEP1S/SPICLKC/SCITXDB) U12.14(DATA_IN)
VFD_RS: U1.72(GPIO23/EQEP1I/SPISTEC/SCIRXDB) U12.15(RS)
W0: R28.2 U1.1(GPIO12/TZ1#/CANTXB/SPISIMOB) U17.7(I7)
W1: R29.2 U1.95(GPIO13/TZ2#/CANRXB/SPISOMIB) U17.8(I8)
WW0: U17.12(O7)
WW1: U17.11(O8)
$1N7775: U4.4(1EN#) U9.4(Y)
$2N878: H2.2 SW3.1
$2N883: D1.1 H3.1 Q1.3(D)
$2N1936: H5.2 U16.13(OUTA+) U16.14(OUTA+)
$2N1937: H5.1 U16.17(OUTA-) U16.18(OUTA-)
$2N1938: H4.1 U16.19(OUTB-) U16.20(OUTB-)
$2N1939: H4.2 U16.23(OUTB+) U16.24(OUTB+)
Net-(C1-2): C1.2 U1.37(ADCREFP)
Net-(C2-1): C2.1 U1.36(ADCREFM)
Net-(C3-1): C3.1 C4.1 L1.2 X1.4(VDD)
Net-(C31-2): C31.2 R7.1 U9.2(A)
Net-(C39-1): C39.1 L7.1 U10.3(SW)
Net-(C39-2): C39.2 U10.1(BS)
Net-(C40-1): C40.1 U10.8(SS)
Net-(C43-1): C43.1 R12.1
Net-(C43-2): C43.2 U10.6(COMP)
Net-(C46-1): C46.1 R20.1 U16.1(TBLKAB) U16.33(VCC) U16.34(VCC)
Net-(L2-2): L2.2 X1.2(VSS)
Net-(Q1-1): Q1.1(G) R18.1
Net-(R1-2): R1.2 U1.38(ADCRESEXT)
Net-(R2-1): R2.1 X1.3(QOUT)
Net-(R3-1): R3.1 SW1.2
Net-(R4-1): R4.1 SW1.3
Net-(R9-1): R9.1 U10.7(EN)
Net-(R10-1): R10.1 R11.2 U10.5(FB)
Net-(R20-2): R20.2 R21.2 U16.31(VREFB) U16.32(VREFA)

Not connected (* = marked no-connect by the designer): H6 3*; SW3 3*; SW4 3(C)*; U1 34(ADCINB7)* 66(XCLKOUT)* 73(TDI)* 74(TMS)* 75(TCK)* 76(TDO)* 80(EMU0)* 81(EMU1)* 84(TRST#)* 86(X2)* 97(TEST1)* 98(TEST2)*; U4 29(EP)*; U9 1(N.C)*; U11 2(OUT)*; U12 25(OSC) 26(DATA_OUT); U13 4(G)* 12(G#)*; U14 1* 4* 9* 10*; U15 1* 4* 9* 10*; U16 3(NC)* 4(NC)* 5(NC)* 6(NC)* 7(NC)* 9(NC)* 12(NC)* 25(NC)* 28(NC)* 36(NC)* 37(NC)* 38(NC)* 45(NC)* 46(NC)* 47(LO1)* 48(LO2)*; U17 10(CD+)*; U18 4(INT1)* 9(INT2)* 10(OCS_AUX)* 11(SDO_AUX)*; X1 1(INHB)*

## Notes on the sheets
sheet 1
- 오실
  X1
  R2
  C3~C4
  L1~L2
- 롬
  U2
  C5
- 리셋
  SW2
  R8
  C35
- 부트
  SW1
  R3~R6
- SCI포트
  H1
- 5V
  C6~C7
- 3.3V
  C8~C13
- 1.8V
  C14~C21
- 레귤
  U4~U9
  R7
  C24~C34
- U3
  L4~L5
  C24~C28
- L6
- L3
  C22~C23
- CPU PERIPHRALS
- MCU
  U1
  R1
  C1~C2
- GPIO 설정 완
- TMS320F2809PZA
sheet 2
- 스위칭레귤
  H2
  SW3
  U10
  C37~C43
  R9~R12
  L7
- 선형레귤
  U11
  C36 - 제거(11.07)
- POWER
- 조그
  SW4
  R13~R17
  R14 제거(11.07)
- LMOTOR
  U14
- JOG
- RMOTOR
  U15
- 스위칭레귤
  H4~H5
  U16
  C44~C46
  R20~R21
- 팬
  H3
  R18~R19
  Q1
  D1
- FAN
- AM26LS32
  U13
- VFD
  U12
- VFD
- MOTOR
sheet 3
- 센서보드
  H6
- ULN
  U17
  R22~R29
- 메인보드에 날개 구멍 뚫기
  -WW0,WW1
  -LQQ1,LQQ2,RQQ1,RQQ2
- 수발광
  C47~C61
  R30~R59
- AGND?
- ADC
- 자이로
  U18
  C62~C63
- GYRO
